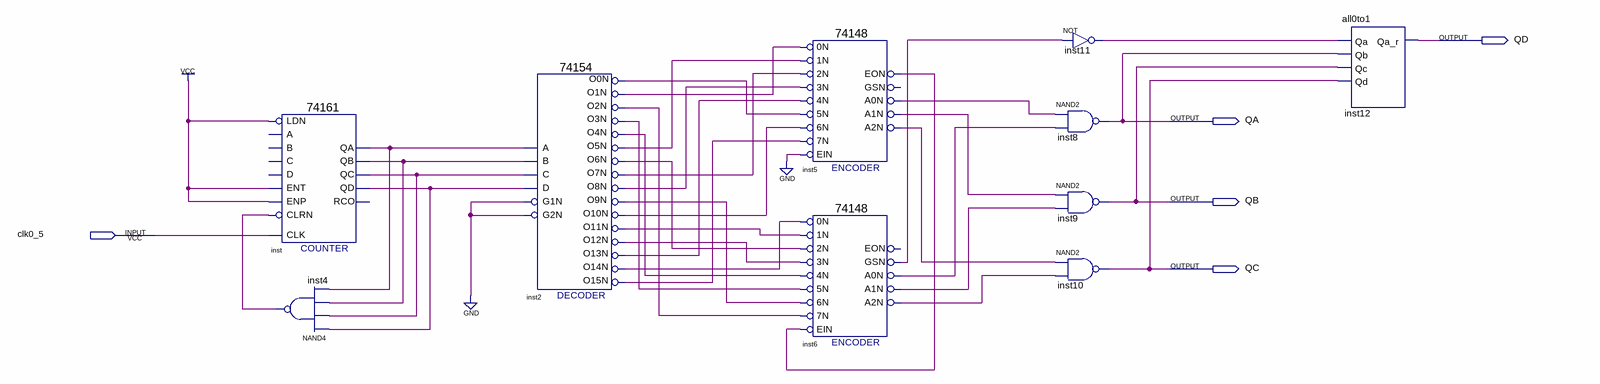
[diagram p0: schematic sheet]
// Quartus schematic random.bdf as structural Verilog: 10 symbols, 5 pins
module random (
  input  clk0_5,
  output QD,
  output QA,
  output QB,
  output QC
);

  wire inst2_o0n, inst2_o1n, inst2_o2n, inst2_o3n, inst2_o4n, inst2_o5n, inst2_o6n, inst2_o7n, inst2_o8n,
       inst2_o9n, inst2_o10n, inst2_o11n, inst2_o12n, inst2_o13n, inst2_o14n, inst2_o15n, inst4_out,
       inst5_a0n, inst5_a1n, inst5_a2n, inst5_eon, inst6_a0n, inst6_a1n, inst6_a2n, inst6_gsn, inst11_out,
       inst_qa, inst_qb, inst_qc, inst_qd;

  \74161  inst (
    .CLRN(inst4_out), .CLK(clk0_5), .ENP(1'b1), .LDN(1'b1), .ENT(1'b1), .QD(inst_qd), .QC(inst_qc),
    .QB(inst_qb), .QA(inst_qa));  // open: A, D, B, C, RCO
  nand inst4 (inst4_out, inst_qd, inst_qc, inst_qb, inst_qa);
  \74154  inst2 (
    .C(inst_qc), .D(inst_qd), .B(inst_qb), .A(inst_qa), .G1N(1'b0), .G2N(1'b0), .O0N(inst2_o0n),
    .O12N(inst2_o12n), .O15N(inst2_o15n), .O10N(inst2_o10n), .O11N(inst2_o11n), .O1N(inst2_o1n),
    .O13N(inst2_o13n), .O14N(inst2_o14n), .O4N(inst2_o4n), .O3N(inst2_o3n), .O2N(inst2_o2n), .O7N(inst2_o7n),
    .O6N(inst2_o6n), .O5N(inst2_o5n), .O9N(inst2_o9n), .O8N(inst2_o8n));
  \74148  inst5 (
    .\5N (inst2_o0n), .\0N (inst2_o1n), .\1N (inst2_o5n), .\2N (inst2_o7n), .\3N (inst2_o8n),
    .\4N (inst2_o13n), .EIN(1'b0), .\6N (inst2_o10n), .\7N (inst2_o15n), .A1N(inst5_a1n), .A0N(inst5_a0n),
    .A2N(inst5_a2n), .EON(inst5_eon));  // open: GSN
  \74148  inst6 (
    .\5N (inst2_o3n), .\0N (inst2_o14n), .\1N (inst2_o11n), .\2N (inst2_o6n), .\3N (inst2_o12n),
    .\4N (inst2_o4n), .EIN(inst5_eon), .\6N (inst2_o9n), .\7N (inst2_o2n), .A1N(inst6_a1n), .A0N(inst6_a0n),
    .A2N(inst6_a2n), .GSN(inst6_gsn));  // open: EON
  not inst11 (inst11_out, inst6_gsn);
  nand inst8 (QA, inst5_a0n, inst6_a0n);
  nand inst9 (QB, inst5_a1n, inst6_a1n);
  nand inst10 (QC, inst5_a2n, inst6_a2n);
  all0to1 inst12 (.Qa(inst11_out), .Qb(QA), .Qc(QB), .Qd(QC), .Qa_r(QD));
endmodule
